# EAGLE design BME280_Daughter (EAGLE 8.2.1)
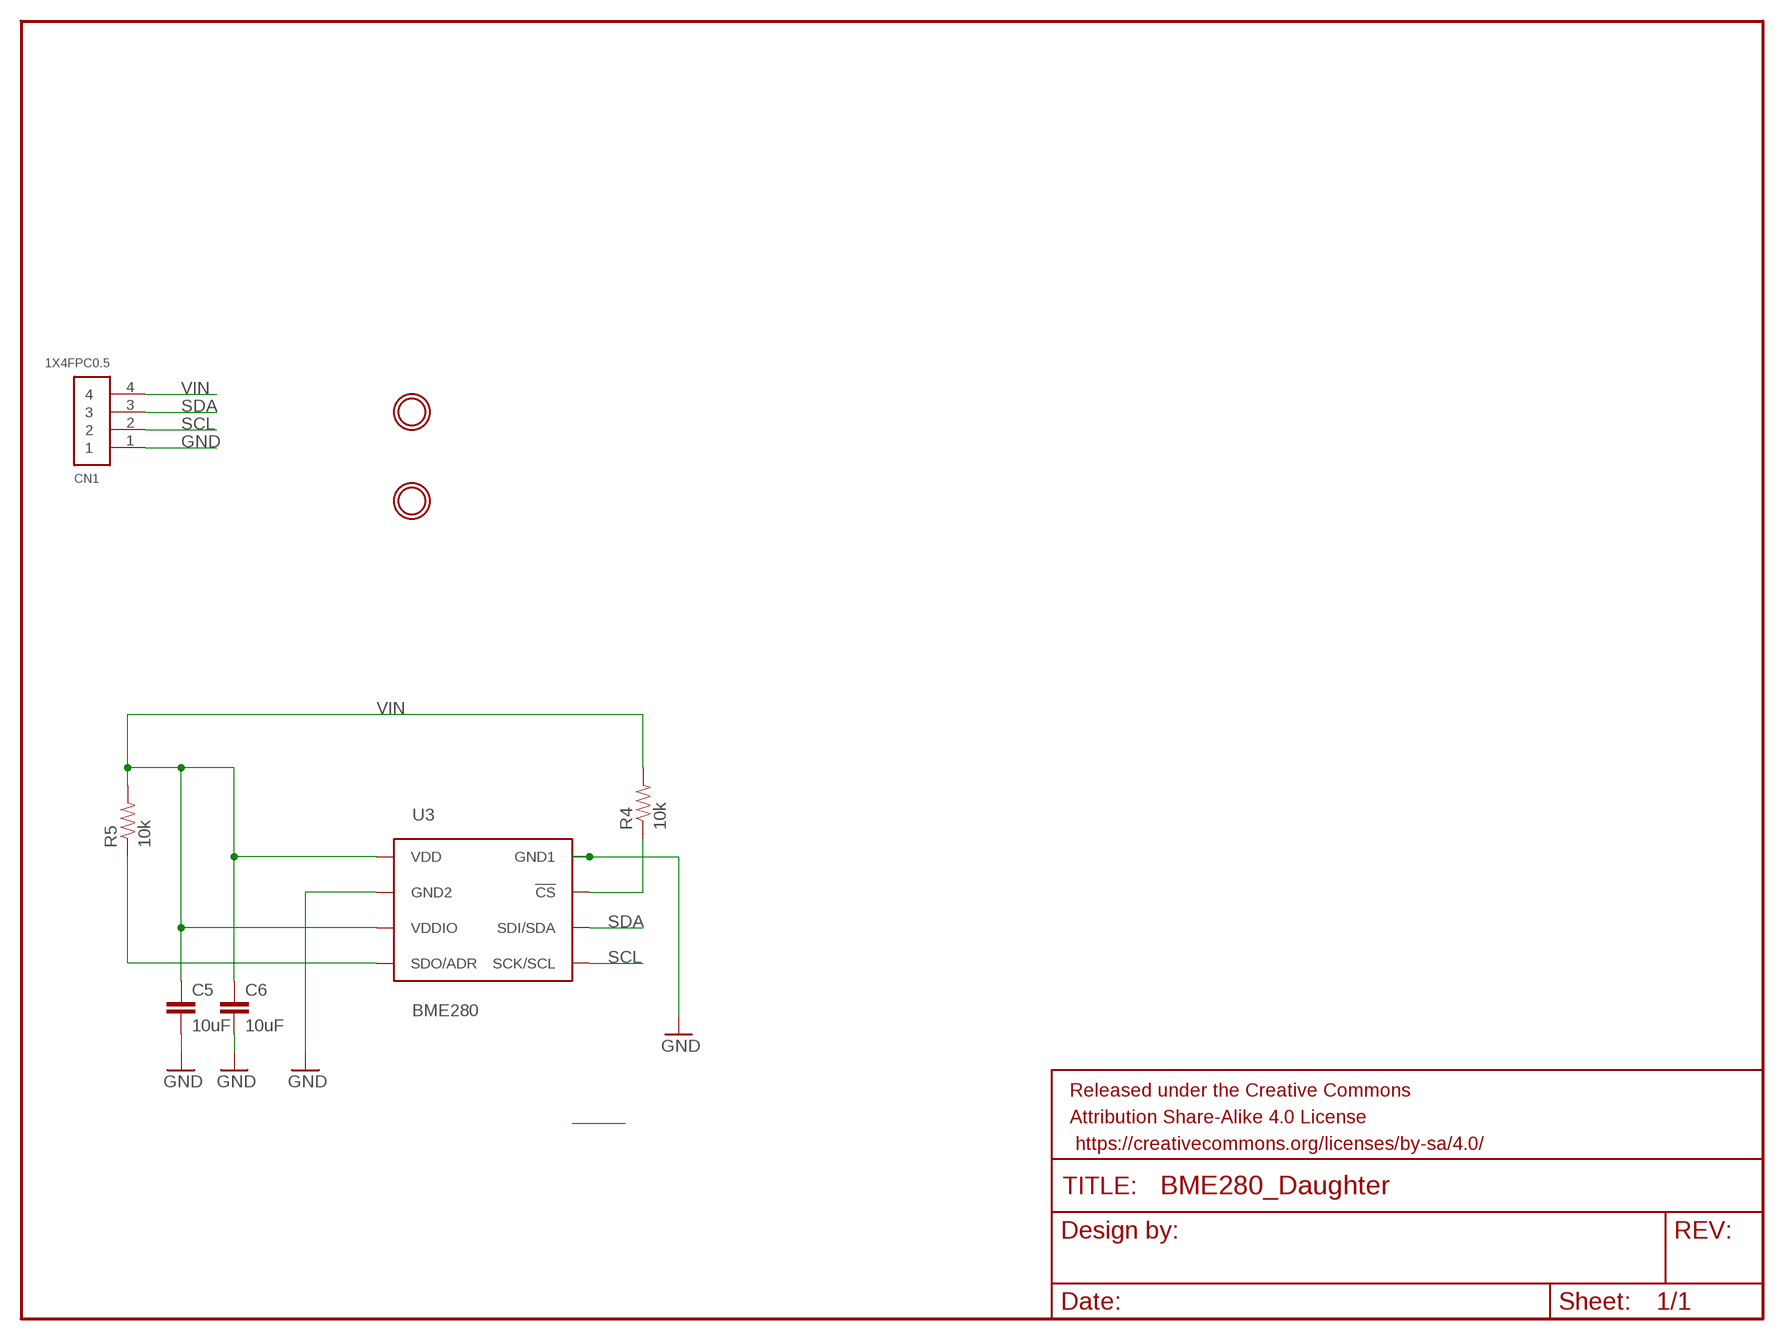
[diagram p0: schematic, sheet 1]

## Parts
C5  10uF  CAP0805  [0805]
C6  10uF  CAP0805  [0805]
CN1  1X4FPC0.5  [FPC_0.5MM-4]
FRAME1  FRAME-LETTER  [CREATIVE_COMMONS]
R4  10k  RESISTOR0805-RES  [0805]
R5  10k  RESISTOR0805-RES  [0805]
U3  BME280  [BME280_LGA]
U$1  MOUNTINGHOLE2.0  [MOUNTINGHOLE_2.0_PLATED]
U$2  MOUNTINGHOLE2.0  [MOUNTINGHOLE_2.0_PLATED]

## Nets
GND: C5.2 C6.2 CN1.1 U3.P$1(GND1) U3.P$7(GND2)
N$5: R4.1 U3.P$2(!CS)
N$17: R5.1 U3.P$5(SDO/ADR)
SCL: CN1.2 U3.P$4(SCK/SCL)
SDA: CN1.3 U3.P$3(SDI/SDA)
VIN: C5.1 C6.1 CN1.4 R4.2 R5.2 U3.P$6(VDDIO) U3.P$8(VDD)

## Library data of the parts
C5 C6 = SparkFun-Capacitors:CAP: Capacitor Standard 0603 ceramic capacitor, and 0.1" leaded capacitor.
CN1 = adafruit:1X4: 4-pin connector
FRAME1 = SparkFun-Aesthetics:FRAME-LETTER: Schematic Frame Standard 8.5x11 US Letter frame
R4 R5 = SparkFun-Passives:RESISTOR: Resistor Basic schematic elements and footprints for 0603, 1206, and PTH resistors.
U3 = BME280ComponentLibrary:BME280; PROD_ID: IC-13090
U$1 U$2 = Adafruit CP2104 Friend:MOUNTINGHOLE: Mounting Hole For #2 screws (0.086"/2.18mm width, 0.094"/2.4mm hole) use 2.5mm; BOM: EXCLUDE

## Board
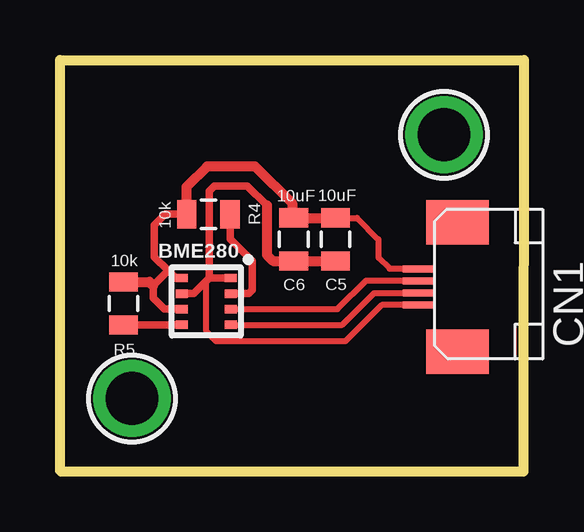
[diagram p1: board, top side]

Size 19.33 x 17.17 mm. Coordinates in mm from the lower left corner, seen from the top.
Outline: 0,0.05 0.01,17.16 19.33,17.17 19.31,0 0.05,0
Copper layers (1*16): Top 0.035mm / dielectric 1.5mm / Bottom 0.035mm
Design rules "SparkFun": minimum track width 8mil, minimum drill 20mil, track to track 8mil, track to pad 8mil, pad to pad 8mil, via to via 8mil, smd to smd 8mil, copper to edge 8mil, drill to drill 8mil, minimum pad ring 12mil, minimum via ring 10mil, stop-mask expansion 4mil, vias tented up to drill 20mil, thermal gap 10mil

### Footprints (pad centres in the part's own frame; a part is rotated, then mirrored left to right if it is on the bottom)
0805 = smd 0.8 x 1.2: 1 -0.9,0; 2 0.9,0
FPC_0.5MM-4 = smd 0.3 x 1.25: 1 -0.75,-0.45; 2 -0.25,-0.45; 3 0.25,-0.45; 4 0.75,-0.45 | smd 1.85 x 2.6: MT -2.7,-2.1; MT2 2.7,-2.1
BME280_LGA = smd 0.5 x 0.35: P$1 1.025,0.975; P$2 1.025,0.325; P$3 1.025,-0.325; P$4 1.025,-0.975; P$5 -1.025,-0.975; P$6 -1.025,-0.325; P$7 -1.025,0.325; P$8 -1.025,0.975
MOUNTINGHOLE_2.0_PLATED = drill 2.2 pad 3: P$1 0,0

### Placement (x,y rotation side)
C5  11.47,9.69 270 top
C6  9.74,9.69 270 top
CN1  14.46,7.7 90 top
FRAME1  21.59,-8.84 0 top  (outside the outline)
R4  6.18,10.74 180 top
R5  2.65,7.01 90 top
U3  6.09,7.1 0 top
U$1  16,14.05 0 top
U$2  3,3.05 0 top

### Tracks (layer width: path | path; a pad name or v marks a point on that pad's centre or on a via)
GND
  Top 0.254: CN1.1 13.4,6.95 11.89,5.44 6.51,5.44 6.1,5.85 6.1,7.96 6.22,8.08
  Top 0.305: U3.P$7 5.57,7.42 6.22,8.08 | 6.22,8.08 U3.P$1 | 8.62,11.11 7.81,11.92 6.42,11.92 6.21,11.71 6.21,8.09 6.22,8.08
  Top 0.406: C5.2 C6.2 8.87,8.79 8.62,9.04 8.62,11.11
N$5
  Top 0.305: U3.P$2 7.86,7.42 8.01,7.58 8.01,8.78 7.09,9.7 7.09,10.73 R4.1
N$17
  Top 0.305: 3.1,6.12 U3.P$5
  Top 0.406: R5.1 3.08,6.12 3.1,6.12
SCL
  Top 0.254: U3.P$4 11.77,6.12 13.09,7.45 CN1.2
SDA
  Top 0.254: U3.P$3 11.55,6.77 12.75,7.97 14.15,7.97 | 14.15,7.97 | 14.15,7.97 14.89,7.97 CN1.3
  Top 0.305: 7.11,6.76 U3.P$3
VIN
  Top 0.254: C5.1 12.38,10.59 13.27,9.69 13.27,8.93 13.73,8.47 14.89,8.47 CN1.4
  Top 0.305: U3.P$8 4.82,8.08 4.5,8.39 | 4.5,8.39 3.93,8.96 3.93,10.29 4.38,10.74 R4.2 | U3.P$6 4.34,6.77 3.88,7.24 3.88,7.76 4.5,8.39
  Top 0.406: R4.2 5.28,11.88 6.13,12.73 8.13,12.73 9.67,11.19 9.67,10.66 C6.1 C5.1 | 3.88,7.76 3.73,7.92 R5.2